# Altium project BW1092_R0M0E0.PrjPcb (part 3 of 7)

## Sheet BW1092_Connector.SchDoc: =project_title
size Tabloid; CompanyName: Luxonis Holding; DrawnBy: Brian Weinstein; Organization: Luxonis Holding; Address1: 1925 Harmony Park Drive; Address2: Westminster, CO; Address3: 80234; Address4: United States; DocumentNumber: DXXXX; Revision: R0M0E0; SheetNumber: 3; SheetTotal: 12
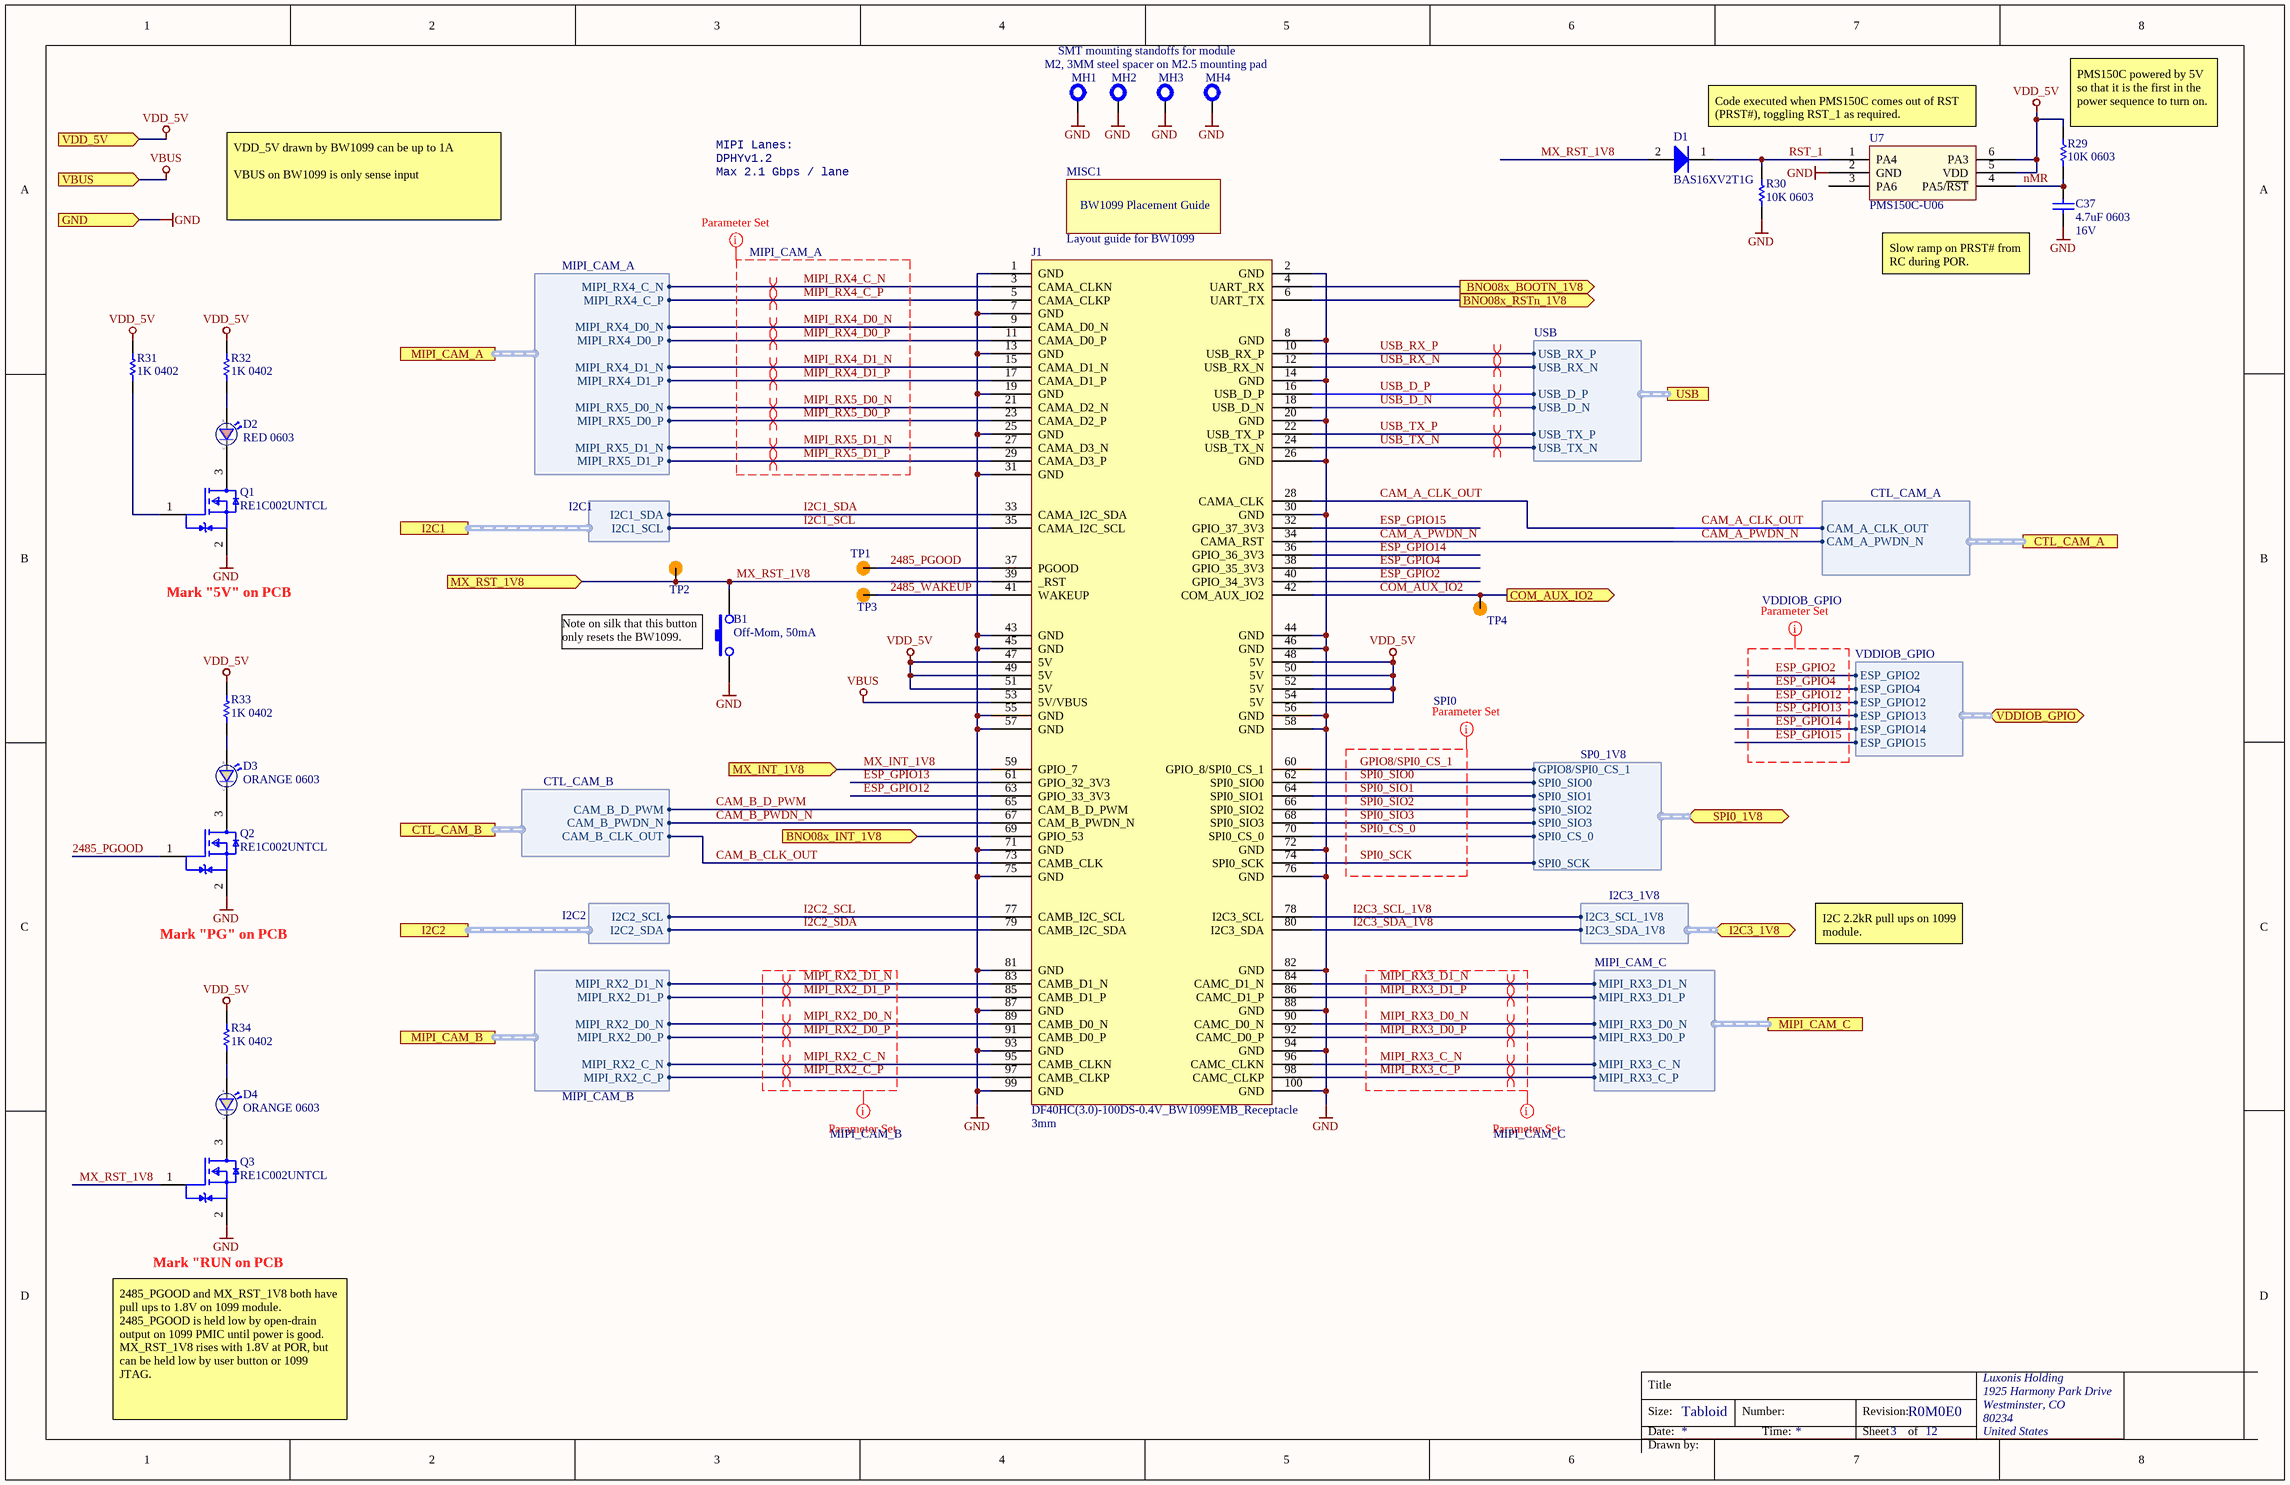
[diagram p2: BW1092_Connector.SchDoc]

### Parts
B1  Off-Mom, 50mA  [DTSM-32N-V]
C37  4.7uF 0603  Voltage Rating: 16V  [CAPC0603(1608)100_N]
D1  BAS16XV2T1G  [BAS16XV2T1G]
D2  RED 0603  [SML_D1xx8W]
D3  ORANGE 0603  [SML_D1xx8W]
D4  ORANGE 0603  [SML_D1xx8W]
J1  DF40HC(3.0)-100DS-0.4V_BW1099EMB_Receptacle  Mated Stacking Height: 3mm  [DF40HC-3.0-100DS-0.4V_minpad]
MH1  M2, 3MM steel spacer on M2.5 mounting pad  [9774030243R]  (value not drawn)
MH2  M2, 3MM steel spacer on M2.5 mounting pad  [9774030243R]  (value not drawn)
MH3  M2, 3MM steel spacer on M2.5 mounting pad  [9774030243R]  (value not drawn)
MH4  M2, 3MM steel spacer on M2.5 mounting pad  [9774030243R]
MISC1  Layout guide for BW1099  [BW1099_R3_KTHSNF_Footprint]  (no BOM)
Q1  RE1C002UNTCL  [RE1C002UNTCL]
Q2  RE1C002UNTCL  [RE1C002UNTCL]
Q3  RE1C002UNTCL  [RE1C002UNTCL]
R29  10K 0603  [RESC0603(1608)_N]
R30  10K 0603  [RESC0603(1608)_N]
R31  1K 0402  [RESC0402(1005)_L]
R32  1K 0402  [RESC0402(1005)_L]
R33  1K 0402  [RESC0402(1005)_L]
R34  1K 0402  [RESC0402(1005)_L]
TP1  TP100_200_NS  [TP100_200_NS]  (value not drawn)  (no BOM)
TP2  TP100_200_NS  [TP100_200_NS]  (value not drawn)  (no BOM)
TP3  TP100_200_NS  [TP100_200_NS]  (value not drawn)  (no BOM)
TP4  TP100_200_NS  [TP100_200_NS]  (value not drawn)  (no BOM)
U7  PMS150C-U06  [PMS150C-U06]

### Ports
BNO08x_BOOTN_1V8 (out), BNO08x_INT_1V8 (in), BNO08x_RSTn_1V8 (out), COM_AUX_IO2 (out), CTL_CAM_A (harness CTL_CAM_A), CTL_CAM_B (harness CTL_CAM_B), GND (in), I2C1 (harness I2C1), I2C2 (harness I2C2), I2C3_1V8 (bidir, harness I2C3_1V8), MIPI_CAM_A (harness MIPI_CAM_A), MIPI_CAM_B (harness MIPI_CAM_B), MIPI_CAM_C (harness MIPI_CAM_C), MX_INT_1V8 (in), MX_RST_1V8 (in), SPI0_1V8 (bidir, harness SP0_1V8), USB (harness USB), VBUS (in), VDD_5V (in), VDDIOB_GPIO (bidir, harness VDDIOB_GPIO)

### Harnesses
MIPI_CAM_B: MIPI_RX2_C_P, MIPI_RX2_C_N, MIPI_RX2_D0_P, MIPI_RX2_D0_N, MIPI_RX2_D1_P, MIPI_RX2_D1_N
MIPI_CAM_A: MIPI_RX4_C_P, MIPI_RX4_C_N, MIPI_RX4_D0_P, MIPI_RX4_D0_N, MIPI_RX4_D1_P, MIPI_RX4_D1_N, MIPI_RX5_D0_P, MIPI_RX5_D0_N, MIPI_RX5_D1_P, MIPI_RX5_D1_N
MIPI_CAM_C: MIPI_RX3_C_P, MIPI_RX3_C_N, MIPI_RX3_D0_P, MIPI_RX3_D0_N, MIPI_RX3_D1_P, MIPI_RX3_D1_N
I2C2: I2C2_SDA, I2C2_SCL
I2C1: I2C1_SDA, I2C1_SCL
CTL_CAM_B: CAM_B_CLK_OUT, CAM_B_PWDN_N, CAM_B_D_PWM
USB: USB_D_P, USB_D_N, USB_TX_N, USB_TX_P, USB_RX_N, USB_RX_P
CTL_CAM_A: CAM_A_PWDN_N, CAM_A_CLK_OUT
SP0_1V8: SPI0_SIO1, SPI0_SIO2, SPI0_SIO3, GPIO8/SPI0_CS_1, SPI0_SIO0, SPI0_CS_0, SPI0_SCK
I2C3_1V8: I2C3_SCL_1V8, I2C3_SDA_1V8
VDDIOB_GPIO: ESP_GPIO2, ESP_GPIO4, ESP_GPIO12, ESP_GPIO13, ESP_GPIO14, ESP_GPIO15

### Nets
GND: B1.1 C37.1 J1.1(GND) J1.2(GND) J1.7(GND) J1.8(GND) J1.13(GND) J1.14(GND) J1.19(GND) J1.20(GND) J1.25(GND) J1.26(GND) J1.30(GND) J1.31(GND) J1.43(GND) J1.44(GND) J1.45(GND) J1.46(GND) J1.55(GND) J1.56(GND) J1.57(GND) J1.58(GND) J1.71(GND) J1.72(GND) J1.75(GND) J1.76(GND) J1.81(GND) J1.82(GND) J1.87(GND) J1.88(GND) J1.93(GND) J1.94(GND) J1.99(GND) J1.100(GND) MH1.1 MH2.1 MH3.1 MH4.1 Q1.2(Source) Q2.2(Source) Q3.2(Source) R30.1 U7.2(GND) ; port GND
VBUS: J1.53(5V/VBUS) ; port VBUS
VDD_5V: J1.47(5V) J1.48(5V) J1.49(5V) J1.50(5V) J1.51(5V) J1.52(5V) J1.54(5V) R29.2 R31.2 R32.2 R33.2 R34.2 U7.5(VDD) U7.6(PA3) ; port VDD_5V
2485_PGOOD: J1.37(PGOOD) Q2.1(Gate) TP1.1
2485_WAKEUP: J1.41(WAKEUP) TP3.1
CAM_A_CLK_OUT: J1.28(CAMA_CLK) ; port CTL_CAM_A.CAM_A_CLK_OUT
CAM_A_PWDN_N: J1.34(CAMA_RST) ; port CTL_CAM_A.CAM_A_PWDN_N
CAM_B_CLK_OUT: J1.73(CAMB_CLK) ; port CTL_CAM_B.CAM_B_CLK_OUT
CAM_B_D_PWM: J1.65(CAM_B_D_PWM) ; port CTL_CAM_B.CAM_B_D_PWM
CAM_B_PWDN_N: J1.67(CAM_B_PWDN_N) ; port CTL_CAM_B.CAM_B_PWDN_N
COM_AUX_IO2: J1.42(COM_AUX_IO2) TP4.1 ; port COM_AUX_IO2
ESP_GPIO2: J1.40(GPIO_34_3V3) ; port VDDIOB_GPIO.ESP_GPIO2
ESP_GPIO4: J1.38(GPIO_35_3V3) ; port VDDIOB_GPIO.ESP_GPIO4
ESP_GPIO12: J1.63(GPIO_33_3V3) ; port VDDIOB_GPIO.ESP_GPIO12
ESP_GPIO13: J1.61(GPIO_32_3V3) ; port VDDIOB_GPIO.ESP_GPIO13
ESP_GPIO14: J1.36(GPIO_36_3V3) ; port VDDIOB_GPIO.ESP_GPIO14
ESP_GPIO15: J1.32(GPIO_37_3V3) ; port VDDIOB_GPIO.ESP_GPIO15
GPIO8/SPI0_CS_1: J1.60(GPIO_8/SPI0_CS_1) ; port SPI0_1V8.GPIO8/SPI0_CS_1
I2C1_SCL: J1.35(CAMA_I2C_SCL) ; port I2C1.I2C1_SCL
I2C1_SDA: J1.33(CAMA_I2C_SDA) ; port I2C1.I2C1_SDA
I2C2_SCL: J1.77(CAMB_I2C_SCL) ; port I2C2.I2C2_SCL
I2C2_SDA: J1.79(CAMB_I2C_SDA) ; port I2C2.I2C2_SDA
I2C3_SCL_1V8: J1.78(I2C3_SCL) ; port I2C3_1V8.I2C3_SCL_1V8
I2C3_SDA_1V8: J1.80(I2C3_SDA) ; port I2C3_1V8.I2C3_SDA_1V8
MIPI_RX2_C_N: J1.95(CAMB_CLKN) ; port MIPI_CAM_B.MIPI_RX2_C_N
MIPI_RX2_C_P: J1.97(CAMB_CLKP) ; port MIPI_CAM_B.MIPI_RX2_C_P
MIPI_RX2_D0_N: J1.89(CAMB_D0_N) ; port MIPI_CAM_B.MIPI_RX2_D0_N
MIPI_RX2_D0_P: J1.91(CAMB_D0_P) ; port MIPI_CAM_B.MIPI_RX2_D0_P
MIPI_RX2_D1_N: J1.83(CAMB_D1_N) ; port MIPI_CAM_B.MIPI_RX2_D1_N
MIPI_RX2_D1_P: J1.85(CAMB_D1_P) ; port MIPI_CAM_B.MIPI_RX2_D1_P
MIPI_RX3_C_N: J1.96(CAMC_CLKN) ; port MIPI_CAM_C.MIPI_RX3_C_N
MIPI_RX3_C_P: J1.98(CAMC_CLKP) ; port MIPI_CAM_C.MIPI_RX3_C_P
MIPI_RX3_D0_N: J1.90(CAMC_D0_N) ; port MIPI_CAM_C.MIPI_RX3_D0_N
MIPI_RX3_D0_P: J1.92(CAMC_D0_P) ; port MIPI_CAM_C.MIPI_RX3_D0_P
MIPI_RX3_D1_N: J1.84(CAMC_D1_N) ; port MIPI_CAM_C.MIPI_RX3_D1_N
MIPI_RX3_D1_P: J1.86(CAMC_D1_P) ; port MIPI_CAM_C.MIPI_RX3_D1_P
MIPI_RX4_C_N: J1.3(CAMA_CLKN) ; port MIPI_CAM_A.MIPI_RX4_C_N
MIPI_RX4_C_P: J1.5(CAMA_CLKP) ; port MIPI_CAM_A.MIPI_RX4_C_P
MIPI_RX4_D0_N: J1.9(CAMA_D0_N) ; port MIPI_CAM_A.MIPI_RX4_D0_N
MIPI_RX4_D0_P: J1.11(CAMA_D0_P) ; port MIPI_CAM_A.MIPI_RX4_D0_P
MIPI_RX4_D1_N: J1.15(CAMA_D1_N) ; port MIPI_CAM_A.MIPI_RX4_D1_N
MIPI_RX4_D1_P: J1.17(CAMA_D1_P) ; port MIPI_CAM_A.MIPI_RX4_D1_P
MIPI_RX5_D0_N: J1.21(CAMA_D2_N) ; port MIPI_CAM_A.MIPI_RX5_D0_N
MIPI_RX5_D0_P: J1.23(CAMA_D2_P) ; port MIPI_CAM_A.MIPI_RX5_D0_P
MIPI_RX5_D1_N: J1.27(CAMA_D3_N) ; port MIPI_CAM_A.MIPI_RX5_D1_N
MIPI_RX5_D1_P: J1.29(CAMA_D3_P) ; port MIPI_CAM_A.MIPI_RX5_D1_P
MX_INT_1V8: J1.59(GPIO_7) ; port MX_INT_1V8
MX_RST_1V8: B1.2 D1.2(A) J1.39(_RST) Q3.1(Gate) TP2.1 ; port MX_RST_1V8
nMR: C37.2 R29.1 U7.4(PA5/~{RST})
RST_1: D1.1(K) R30.2 U7.1(PA4)
SPI0_CS_0: J1.70(SPI0_CS_0) ; port SPI0_1V8.SPI0_CS_0
SPI0_SCK: J1.74(SPI0_SCK) ; port SPI0_1V8.SPI0_SCK
SPI0_SIO0: J1.62(SPI0_SIO0) ; port SPI0_1V8.SPI0_SIO0
SPI0_SIO1: J1.64(SPI0_SIO1) ; port SPI0_1V8.SPI0_SIO1
SPI0_SIO2: J1.66(SPI0_SIO2) ; port SPI0_1V8.SPI0_SIO2
SPI0_SIO3: J1.68(SPI0_SIO3) ; port SPI0_1V8.SPI0_SIO3
USB_D_N: J1.18(USB_D_N) ; port USB.USB_D_N
USB_D_P: J1.16(USB_D_P) ; port USB.USB_D_P
USB_RX_N: J1.12(USB_RX_N) ; port USB.USB_RX_N
USB_RX_P: J1.10(USB_RX_P) ; port USB.USB_RX_P
USB_TX_N: J1.24(USB_TX_N) ; port USB.USB_TX_N
USB_TX_P: J1.22(USB_TX_P) ; port USB.USB_TX_P
NetD2_1: D2.1(C) Q1.3(Drain)
NetD2_2: D2.2(A) R32.1
NetD3_1: D3.1(C) Q2.3(Drain)
NetD3_2: D3.2(A) R33.1
NetD4_1: D4.1(C) Q3.3(Drain)
NetD4_2: D4.2(A) R34.1
NetJ1_4: J1.4(UART_RX) ; port BNO08x_BOOTN_1V8
NetJ1_6: J1.6(UART_TX) ; port BNO08x_RSTn_1V8
NetJ1_69: J1.69(GPIO_53) ; port BNO08x_INT_1V8
NetQ1_1: Q1.1(Gate) R31.1

Not connected (* = marked no-connect by the designer): U7 3(PA6)

### Layout directives
net class MIPI_CAM_C; rule Matched Net Lengths [Delay Tolerance = 1ps]: MIPI_RX3_C_N, MIPI_RX3_C_P, MIPI_RX3_D0_N, MIPI_RX3_D0_P, MIPI_RX3_D1_N, MIPI_RX3_D1_P
net class MIPI_CAM_A; rule Matched Net Lengths [Delay Tolerance = 1ps]: MIPI_RX4_C_N, MIPI_RX4_C_P, MIPI_RX4_D0_N, MIPI_RX4_D0_P, MIPI_RX4_D1_N, MIPI_RX4_D1_P, MIPI_RX5_D0_N, MIPI_RX5_D0_P, MIPI_RX5_D1_N, MIPI_RX5_D1_P
net class MIPI_CAM_B; rule Matched Net Lengths [Delay Tolerance = 1ps]: MIPI_RX2_C_N, MIPI_RX2_C_P, MIPI_RX2_D0_N, MIPI_RX2_D0_P, MIPI_RX2_D1_N, MIPI_RX2_D1_P
differential pair; differential pair class 100ohm: MIPI_RX2_C_N, MIPI_RX2_C_P, MIPI_RX2_D0_N, MIPI_RX2_D0_P, MIPI_RX2_D1_N, MIPI_RX2_D1_P, MIPI_RX3_C_N, MIPI_RX3_C_P, MIPI_RX3_D0_N, MIPI_RX3_D0_P, MIPI_RX3_D1_N, MIPI_RX3_D1_P, MIPI_RX4_C_N, MIPI_RX4_C_P, MIPI_RX4_D0_N, MIPI_RX4_D0_P, MIPI_RX4_D1_N, MIPI_RX4_D1_P, MIPI_RX5_D0_N, MIPI_RX5_D0_P, MIPI_RX5_D1_N, MIPI_RX5_D1_P
differential pair; differential pair class USB3: USB_D_N, USB_D_P, USB_RX_N, USB_RX_P, USB_TX_N, USB_TX_P
net class SPI0; rule Matched Net Lengths [Delay Tolerance = 50ps]: GPIO8/SPI0_CS_1, SPI0_CS_0, SPI0_SCK, SPI0_SIO0, SPI0_SIO1, SPI0_SIO2, SPI0_SIO3
net class VDDIOB_GPIO; rule Matched Net Lengths [Delay Tolerance = 50ps]: ESP_GPIO2, ESP_GPIO4, ESP_GPIO12, ESP_GPIO13, ESP_GPIO14, ESP_GPIO15

### Notes on the sheet
- SMT mounting standoffs for module
- MIPI Lanes:
- DPHYv1.2
- Code executed when PMS150C comes out of RST (PRST#), toggling RST_1 as required.
- (near R29) PMS150C powered by 5V so that it is the first in the power sequence to turn on.
- VDD_5V drawn by BW1099 can be up to 1A
  VBUS on BW1099 is only sense input
- Max 2.1 Gbps / lane
- Slow ramp on PRST# from RC during POR.
- Mark "5V" on PCB
- (near B1) Note on silk that this button only resets the BW1099.
- Mark "PG" on PCB
- I2C 2.2kR pull ups on 1099 module.
- Mark "RUN on PCB
- 2485_PGOOD and MX_RST_1V8 both have pull ups to 1.8V on 1099 module. 2485_PGOOD is held low by open-drain output on 1099 PMIC until power is good. MX_RST_1V8 rises with 1.8V at POR, but can be held low by user button or 1099 JTAG.
- Title
- Size:
- Date:
- Tabloid
- Number:
- Time:
- Revision:
- Sheet
- of
- Drawn by:
- (in symbol BW1099_Footprint) BW1099 Placement Guide

### Library data of the parts
B1 = DTSM-32N-V: SWITCH TACTILE SMT 3.5mm * 6mm , brown 160gf; Manufacturer 1: Diptronics; Manufacturer Part Number 1: DTSM-32N-V-T/R; Supplier 1: Mouser; Stock 1: 3199; Pricing 1: 1=0.38000, 10=0.38000, 50=0.31000, 100=0.28200, 500=0.25600, 1000=0.23600, 1600=0.20900, 4800=0.18800, 9600=0.17300, 10000=0.17300, 24000=0.16100 (USD); RoHS: No; Min Operating Temperature: -30°C; Max Operating Temperature: 80°C; Length: 6mm; Height: 5mm; Width: 3.5mm; ComponentLink1URL: https://datasheet.ciiva.com/29188/708548-da-01-en-tastschalter-smd-dtsm-32n-v-tr-1600st-29188823.pdf?src-supplier=Conrad; ComponentLink1Description: https://datasheet.ciiva.com/29188/708548-da-01-en-tastschalter-smd-dtsm-32n-v-tr-1600st-29188823.pdf?src-supplier=Conrad; Supplier Part Number 1: 113-DTSM32NVTR
C37 = GRM188R61C475KAAJD: CAP CER 4.7UF 16V X5R 0603 10%; Manufacturer 1: Murata; Material: Ceramic; Supplier 1: Digi-Key; Manufacturer Part Number 1: GRM188R61C475KAAJD; Stock 1: 455058; Pricing 1: 1=0.35000, 10=0.24600, 100=0.14730, 500=0.11050, 1000=0.09331 (USD); RoHS: Yes; Mount: Surface Mount; Case/Package: 0603; Weight: 0.000222oz; Case Code (Metric): 1608; Case Code (Imperial): 0603; Min Operating Temperature: -55°C; Max Operating Temperature: 85°C; Capacitance: 4.7uF; Tolerance: 10%; Packaging: Tape and Reel; Dielectric: X5R; Termination: SMD/SMT; Voltage Rating (DC): 16V; Package Quantity: 4000; Length: 1.6mm; Height: 0.8mm; Width: 0.8mm; Thickness: 0.037inch; Depth: 0.8mm; REACH SVHC: No SVHC; Lead Free: Lead Free; ComponentLink1URL: https://datasheet.ciiva.com/14813/595grm188r61c475kaaj23-14813668.pdf?src-supplier=Arrow; ComponentLink1Description: https://datasheet.ciiva.com/14813/595grm188r61c475kaaj23-14813668.pdf?src-supplier=Arrow; Supplier 2: Digi-Key; Manufacturer 2: Murata; Manufacturer Part Number 2: GRM188R61C475KAAJD; Stock 2: 455058; Pricing 2: 1=0.35000, 10=0.24600, 100=0.14730, 500=0.11050, 1000=0.09331 (USD); Supplier 3: Digi-Key; Manufacturer 3: Murata; Manufacturer Part Number 3: GRM188R61C475KAAJD; Stock 3: 452000; Pricing 3: 4000=0.07259, 8000=0.06832, 12000=0.06619, 28000=0.06405 (USD); Supplier Part Number 1: 490-10481-1-ND; Supplier Part Number 2: 490-10481-6-ND; Supplier Part Number 3: 490-10481-2-ND
D1 = BAS16XV2T1G: DIODE GEN PURP 75V 200MA SOD523; Manufacturer 1: ON Semiconductor; Peak Reverse Current: 1uA; Reverse Recovery Time: 6ns; Power Dissipation: 200mW; Element Configuration: Single; Max Surge Current: 500mA; Forward Voltage: 1.25V; Polarity: Standard; Capacitance: 2pF; Supplier 1: Digi-Key; Manufacturer Part Number 1: BAS16XV2T1G; Stock 1: 246371; Pricing 1: 1=0.13000, 10=0.11600, 100=0.06330, 500=0.03898, 1000=0.02658 (USD); RoHS: Yes; Case/Package: SOD-523-2; Number of Pins: 2; Contact Plating: Tin,Matte; Min Operating Temperature: -55°C; Max Operating Temperature: 150°C; Package Quantity: 1; Forward Current: 200mA; Packaging: Tape and Reel; Average Rectified Current: 200mA; Max Repetitive Reverse Voltage (Vrrm): 75V; Max Reverse Voltage (DC): 75V; Recovery Time: 6ns; Max Reverse Leakage Current: 1uA; Peak Non-Repetitive Surge Current: 500mA; Max Forward Surge Current (Ifsm): 500mA; Output Current: 200mA; Length: 1.3mm; Height: 0.7mm; Width: 0.9mm; Radiation Hardening: No; Lead Free: Lead Free; Halogen Free: Halogen Free; REACH SVHC: No SVHC; ComponentLink1URL: https://datasheet.ciiva.com/915/bas16xv2t1-d-915360.pdf?src-supplier=Digi-Key; ComponentLink1Description: https://datasheet.ciiva.com/915/bas16xv2t1-d-915360.pdf?src-supplier=Digi-Key; ComponentLink2URL: https://datasheet.ciiva.com/4434/bas16xv2t1-d-103464-4434928.pdf?src-supplier=Mouser; ComponentLink2Description: https://datasheet.ciiva.com/4434/bas16xv2t1-d-103464-4434928.pdf?src-supplier=Mouser; ComponentLink3URL: https://datasheet.ciiva.com/22663/1708232-22663646.pdf?src-supplier=Element14; ComponentLink3Description: https://datasheet.ciiva.com/22663/1708232-22663646.pdf?src-supplier=Element14; ComponentLink4URL: https://datasheet.ciiva.com/36525/806485-36525908.pdf?src-supplier=Jameco; ComponentLink4Description: https://datasheet.ciiva.com/36525/806485-36525908.pdf?src-supplier=Jameco; ComponentLink5URL: https://datasheet.ciiva.com/15144/getdatasheetpartid-84399-15144565.pdf?src-supplier=Verical; ComponentLink5Description: https://datasheet.ciiva.com/15144/getdatasheetpartid-84399-15144565.pdf?src-supplier=Verical; ComponentLink6URL: https://datasheet.ciiva.com/16475/bas16xv2t1-d-16475723.pdf?src-supplier=Avnet+Asia; ComponentLink6Description: https://datasheet.ciiva.com/16475/bas16xv2t1-d-16475723.pdf?src-supplier=Avnet+Asia; ComponentLink7URL: https://datasheet.ciiva.com/25930/bas16xv2t1-d-25930683.pdf?src-supplier=Avnet+Europe; ComponentLink7Description: https://datasheet.ciiva.com/25930/bas16xv2t1-d-25930683.pdf?src-supplier=Avnet+Europe; Supplier 2: Digi-Key; Manufacturer 2: ON Semiconductor; Manufacturer Part Number 2: BAS16XV2T1G; Stock 2: 246371; Pricing 2: 1=0.13000, 10=0.11600, 100=0.06330, 500=0.03898, 1000=0.02658 (USD); Supplier Part Number 1: BAS16XV2T1GOSCT-ND; Supplier Part Number 2: BAS16XV2T1GOSDKR-ND
D2 = SML-D12U8WT86: LED RED DIFFUSED 0603 SMD Red 620nm LED Indication - Discrete 2.2V 0603 (1608 Metric); Manufacturer 1: Rohm; Lens Color: White,Clear,Diffused; Lens Style: Rectangular,Diffused,Colorless; Forward Current: 20mA; Luminous Intensity: 63mcd; Number of LEDs: 1; Viewing Angle: 160°; RoHS: Yes; Mount: Surface Mount; Case/Package: 0603; Number of Pins: 2; Color: Red; Case Code (Metric): 1608; Case Code (Imperial): 0603; Min Operating Temperature: -40°C; Max Operating Temperature: 85°C; Forward Voltage: 2.2V; Packaging: Tape and Reel; Dominant Wavelength: 620nm; Wavelength: 620nm; Package Quantity: 1; Illumination Color: Red; Test Current: 20mA; Lens Transparency: Diffused; Length: 1.6mm; Height: 0.65mm; Width: 0.8mm; Radiation Hardening: No; REACH SVHC: No SVHC; Lead Free: Lead Free; ComponentLink1URL: https://datasheet.ciiva.com/11774/0900766b80df3ada-11774020.pdf?src-supplier=RSComponents; ComponentLink1Description: https://datasheet.ciiva.com/11774/0900766b80df3ada-11774020.pdf?src-supplier=RSComponents; ComponentLink2URL: https://datasheet.ciiva.com/2110/sml-d1-2110375.pdf?src-supplier=Digi-Key; ComponentLink2Description: https://datasheet.ciiva.com/2110/sml-d1-2110375.pdf?src-supplier=Digi-Key; ComponentLink3URL: https://datasheet.ciiva.com/2110/sml-d1-2110376.pdf?src-supplier=Digi-Key; ComponentLink3Description: https://datasheet.ciiva.com/2110/sml-d1-2110376.pdf?src-supplier=Digi-Key; ComponentLink4URL: https://datasheet.ciiva.com/2110/sml-d1-2110377.pdf?src-supplier=Digi-Key; ComponentLink4Description: https://datasheet.ciiva.com/2110/sml-d1-2110377.pdf?src-supplier=Digi-Key; ComponentLink5URL: https://datasheet.ciiva.com/9324/sml-d1-9324826.pdf?src-supplier=Avnet; ComponentLink5Description: https://datasheet.ciiva.com/9324/sml-d1-9324826.pdf?src-supplier=Avnet; ComponentLink6URL: https://datasheet.ciiva.com/17420/sml-d1-17420939.pdf?src-supplier=Avnet+Europe; ComponentLink6Description: https://datasheet.ciiva.com/17420/sml-d1-17420939.pdf?src-supplier=Avnet+Europe; Supplier 1: Digi-Key; Manufacturer Part Number 1: SML-D12U8WT86; Stock 1: 63748; Pricing 1: 1=0.33000, 10=0.23900, 100=0.11340, 500=0.07560, 1000=0.05922 (USD); Supplier Part Number 1: 511-1580-1-ND
D3 D4 = SML-D12D8WT86: LED ORANGE DIFFUSED 0603 SMD Orange 605nm LED Indication - Discrete 2.2V 0603 (1608 Metric); Manufacturer 1: Rohm; Lens Color: White; Lens Style: Diffused,Colorless,Rectangular; Number of LEDs: 1; Viewing Angle: 160°; Forward Current: 20mA; Luminous Intensity: 100mcd; Supplier 1: Digi-Key; Stock 1: 29355; Pricing 1: 1=0.33000, 10=0.23900, 100=0.11340, 500=0.07560, 1000=0.05922 (USD); RoHS: Yes; Mount: Surface Mount; Case/Package: 0603; Number of Pins: 2; Color: Orange; Case Code (Metric): 1608; Case Code (Imperial): 0603; Min Operating Temperature: -40°C; Max Operating Temperature: 85°C; Dominant Wavelength: 605nm; Forward Voltage: 2.2V; Package Quantity: 1; Packaging: Tape and Reel; Illumination Color: Orange; Test Current: 20mA; Lens Transparency: Diffused; Wavelength: 605nm; Length: 1.6mm; Height: 0.65mm; Width: 0.8mm; Radiation Hardening: No; REACH SVHC: Unknown; Lead Free: Lead Free; ComponentLink1URL: https://datasheet.ciiva.com/2115/sml-d1-2115577.pdf?src-supplier=Digi-Key; ComponentLink1Description: https://datasheet.ciiva.com/2115/sml-d1-2115577.pdf?src-supplier=Digi-Key; ComponentLink2URL: https://datasheet.ciiva.com/2115/sml-d1-2115578.pdf?src-supplier=Digi-Key; ComponentLink2Description: https://datasheet.ciiva.com/2115/sml-d1-2115578.pdf?src-supplier=Digi-Key; ComponentLink3URL: https://datasheet.ciiva.com/3161/sml-d1-3161418.pdf?src-supplier=Avnet; ComponentLink3Description: https://datasheet.ciiva.com/3161/sml-d1-3161418.pdf?src-supplier=Avnet; ComponentLink4URL: https://datasheet.ciiva.com/16387/sml-d1-16387850.pdf?src-supplier=Future+Electronics; ComponentLink4Description: https://datasheet.ciiva.com/16387/sml-d1-16387850.pdf?src-supplier=Future+Electronics; ComponentLink5URL: https://datasheet.ciiva.com/2115/sml-d1-2115579.pdf?src-supplier=Digi-Key; ComponentLink5Description: https://datasheet.ciiva.com/2115/sml-d1-2115579.pdf?src-supplier=Digi-Key; ComponentLink6URL: https://datasheet.ciiva.com/17419/sml-d1-17419886.pdf?src-supplier=Avnet+Europe; ComponentLink6Description: https://datasheet.ciiva.com/17419/sml-d1-17419886.pdf?src-supplier=Avnet+Europe; Supplier Part Number 1: 511-1577-1-ND; Manufacturer Part Number 1: SML-D12D8WT86
J1 = DF40HC(3.0)-100DS-0.4V_BW1099EMB: CONN RCPT 100POS 0.4MM SMD GOLD EMB PINOUT; Manufacturer 1: Hirose; Manufacturer Part Number 1: DF40HC(3.0)-100DS-0.4V(51; Number of Positions: 100; Pitch: 0.016inch; RoHS: Yes; Mount: Surface Mount; Contact Plating: Gold; Packaging: Tape and Reel; Number of Rows: 2; Package Quantity: 1000; Connector Type: Receptacle; Lead Free: Lead Free; ComponentLink1URL: https://datasheet.ciiva.com/46636/ed-df40-20140305-46636517.pdf?src-supplier=Digi-Key; ComponentLink1Description: https://datasheet.ciiva.com/46636/ed-df40-20140305-46636517.pdf?src-supplier=Digi-Key; ComponentLink2URL: https://datasheet.ciiva.com/18562/ed-df40-20140305-18562189.pdf?src-supplier=Digi-Key; ComponentLink2Description: https://datasheet.ciiva.com/18562/ed-df40-20140305-18562189.pdf?src-supplier=Digi-Key; ComponentLink3URL: https://datasheet.ciiva.com/13559/ed-df40-20140305-13559540.pdf?src-supplier=Mouser; ComponentLink3Description: https://datasheet.ciiva.com/13559/ed-df40-20140305-13559540.pdf?src-supplier=Mouser; ComponentLink4URL: https://datasheet.ciiva.com/18562/ed-df40-20140305-18562462.pdf?src-supplier=Digi-Key; ComponentLink4Description: https://datasheet.ciiva.com/18562/ed-df40-20140305-18562462.pdf?src-supplier=Digi-Key; Supplier 1: Mouser; Stock 1: 2172; Pricing 1: 1=2.54000, 10=2.26000, 25=2.07000, 50=2.07000, 100=1.98000, 250=1.79000, 500=1.65000, 1000=1.41000, 3000=1.32000, 6000=1.23000, 10000=1.23000 (USD); Supplier 2: Mouser; Manufacturer 2: Hirose; Manufacturer Part Number 2: DF40HC(3.0)-100DS-0.4V(58); Stock 2: 2078; Pricing 2: 1=2.50000, 10=2.40000, 25=2.10000, 50=2.10000, 100=2.00000, 250=1.76000, 500=1.71000, 1000=1.45000, 2000=1.36000, 5000=1.31000, 10000=1.31000 (USD); Supplier Part Number 1: 798-DF40HC30100DS451; Supplier Part Number 2: 798-DF40HC30100DS458
MH1-MH4 = 9774030243R: MP ROUND STANDOFF M2X0.4 STEEL 3MM; Manufacturer 1: Wurth Electronics; Plating: Tin; Threaded/Unthreaded: Threaded; Outside Diameter: 0.171inch; Supplier 1: Digi-Key; Manufacturer Part Number 1: 9774030243R; Stock 1: 20568; Pricing 1: 1=0.95000, 10=0.91800, 50=0.79500, 100=0.73900 (USD); RoHS: Yes; Material: Steel; Length: 0.173inch; REACH SVHC: Unknown; ComponentLink1URL: http://www.mouser.com/ds/2/445/9774030243R-611455.pdf?src-supplier=Mouser; ComponentLink1Description: http://www.mouser.com/ds/2/445/9774030243R-611455.pdf?src-supplier=Mouser; ComponentLink2URL: http://www.farnell.com/datasheets/1960368.pdf?src-supplier=Farnell; ComponentLink2Description: http://www.farnell.com/datasheets/1960368.pdf?src-supplier=Farnell; ComponentLink3URL: https://katalog.we-online.de/em/datasheet/9774030243R.pdf?src-supplier=Digi-Key; ComponentLink3Description: https://katalog.we-online.de/em/datasheet/9774030243R.pdf?src-supplier=Digi-Key; ComponentLink4URL: http://www.farnell.com/datasheets/1960368.pdf?src-supplier=Newark; ComponentLink4Description: http://www.farnell.com/datasheets/1960368.pdf?src-supplier=Newark; ComponentLink5URL: http://www.farnell.com/datasheets/1960368.pdf?src-supplier=Element14; ComponentLink5Description: http://www.farnell.com/datasheets/1960368.pdf?src-supplier=Element14; Supplier Part Number 1: 732-7085-1-ND
MISC1 = BW1099_Footprint: MISC - Use for aligning BW1099 mount
Q1-Q3 = RE1C002UNTCL: MOSFET N-CH 20V 0.2A EMT3; Manufacturer 1: Rohm; Continuous Drain Current (ID): 200mA; Rds On Max: 1.2R; Input Capacitance: 25pF; Max Power Dissipation: 150mW; RoHS: Yes; Mount: Surface Mount; Case/Package: SOT-89; Packaging: Tape and Reel; Drain to Source Voltage (Vdss): 20V; Lead Free: Lead Free; ComponentLink1URL: http://www.mouser.com/ds/2/348/re1c002untcl-e-1018231.pdf?src-supplier=Mouser; ComponentLink1Description: http://www.mouser.com/ds/2/348/re1c002untcl-e-1018231.pdf?src-supplier=Mouser; ComponentLink2URL: http://rohmfs.rohm.com/en/techdata_basic/transistor/taping/EMT3_TL_taping.pdf?src-supplier=Digi-Key; ComponentLink2Description: http://rohmfs.rohm.com/en/techdata_basic/transistor/taping/EMT3_TL_taping.pdf?src-supplier=Digi-Key; ComponentLink3URL: http://rohmfs.rohm.com/en/products/databook/datasheet/discrete/transistor/mosfet/re1c002un.pdf?src-supplier=Avnet; ComponentLink3Description: http://rohmfs.rohm.com/en/products/databook/datasheet/discrete/transistor/mosfet/re1c002un.pdf?src-supplier=Avnet; ComponentLink4URL: https://www.rohm.com/datasheet/RE1C002UN/re1c002untcl-e?src-supplier=Digi-Key; ComponentLink4Description: https://www.rohm.com/datasheet/RE1C002UN/re1c002untcl-e?src-supplier=Digi-Key; ComponentLink5URL: http://www.farnell.com/datasheets/2704376.pdf?src-supplier=Newark; ComponentLink5Description: http://www.farnell.com/datasheets/2704376.pdf?src-supplier=Newark; ComponentLink6URL: http://www.farnell.com/datasheets/2704376.pdf?src-supplier=Farnell; ComponentLink6Description: http://www.farnell.com/datasheets/2704376.pdf?src-supplier=Farnell; ComponentLink7URL: http://www.farnell.com/datasheets/2704376.pdf?src-supplier=Element14; ComponentLink7Description: http://www.farnell.com/datasheets/2704376.pdf?src-supplier=Element14; Supplier 1: Digi-Key; Manufacturer Part Number 1: RE1C002UNTCL; Stock 1: 868886; Pricing 1: 1=0.20000, 10=0.18200, 100=0.09930, 500=0.06112, 1000=0.04167 (USD); Supplier Part Number 1: RE1C002UNTCLCT-ND
R29 R30 = RC0603FR-0710KL: RES SMD 10K OHM 1% 1/10W 0603; Manufacturer 1: Yageo; Resistance: 10kR; Power Rating: 100mW; Temperature Coefficient: 100ppm/°C; Voltage Rating: 75V; Voltage Rating (DC): 50V; Supplier 1: Digi-Key; Manufacturer Part Number 1: RC0603FR-0710KL; Stock 1: 80414305; Pricing 1: 1=0.10000, 10=0.02200, 100=0.00890, 1000=0.00401, 2500=0.00348 (USD); RoHS: Yes; Case/Package: 0603; Number of Pins: 2; Weight: 7.1E-05oz; Case Code (Imperial): 0603; Case Code (Metric): 1608; Min Operating Temperature: -55°C; Max Operating Temperature: 155°C; Packaging: Tape and Reel; Tolerance: 1%; Composition: Thick Film; Termination: SMD/SMT; Military Standard: Not; Length: 1.6mm; Height: 0.45mm; Depth: 0.8mm; Width: 0.8mm; Lead Pitch: 0.3mm; Lead Free: Lead Free; REACH SVHC: No SVHC; ComponentLink1URL: https://datasheet.ciiva.com/7660/38590-7660789.pdf?src-supplier=Element14; ComponentLink1Description: https://datasheet.ciiva.com/7660/38590-7660789.pdf?src-supplier=Element14; ComponentLink2URL: https://datasheet.ciiva.com/15189/getdatasheetpartid-409289-15189591.pdf?src-supplier=Verical; ComponentLink2Description: https://datasheet.ciiva.com/15189/getdatasheetpartid-409289-15189591.pdf?src-supplier=Verical; ComponentLink3URL: https://datasheet.ciiva.com/46440/1868787-46440891.pdf?src-supplier=Element14; ComponentLink3Description: https://datasheet.ciiva.com/46440/1868787-46440891.pdf?src-supplier=Element14; ComponentLink4URL: https://datasheet.ciiva.com/7983/443971-7983596.pdf?src-supplier=Element14; ComponentLink4Description: https://datasheet.ciiva.com/7983/443971-7983596.pdf?src-supplier=Element14; ComponentLink5URL: https://datasheet.ciiva.com/7746/1738695-7746239.pdf?src-supplier=Element14; ComponentLink5Description: https://datasheet.ciiva.com/7746/1738695-7746239.pdf?src-supplier=Element14; ComponentLink6URL: https://datasheet.ciiva.com/22747/443971-22747519.pdf?src-supplier=Element14; ComponentLink6Description: https://datasheet.ciiva.com/22747/443971-22747519.pdf?src-supplier=Element14; Supplier 2: Digi-Key; Manufacturer 2: Yageo; Manufacturer Part Number 2: RC0603FR-0710KL; Stock 2: 80414305; Pricing 2: 1=0.10000, 10=0.02200, 100=0.00890, 1000=0.00401, 2500=0.00348 (USD); Supplier 3: Digi-Key; Manufacturer 3: Yageo; Manufacturer Part Number 3: RC0603FR-0710KL; Stock 3: 80410000; Pricing 3: 5000=0.00261, 10000=0.00227, 25000=0.00199, 50000=0.00183, 125000=0.00179 (USD); Supplier Part Number 1: 311-10.0KHRCT-ND; Supplier Part Number 2: 311-10.0KHRDKR-ND; Supplier Part Number 3: 311-10.0KHRTR-ND
R31-R34 = RC0402FR-071KL: RES SMD 1K OHM 1% 1/16W 0402 1 kOhms ±1% 0.063W, 1/16W Chip Resistor 0402 (1005 Metric) Moisture Resistant Thick Film; Manufacturer 1: Yageo; Temperature Coefficient: 100ppm/°C; Power Rating: 62.5mW; Voltage Rating (DC): 50V; Resistance: 1kR; RoHS: Yes; Number of Pins: 2; Case Code (Imperial): 0402; Case Code (Metric): 1005; Min Operating Temperature: -55°C; Max Operating Temperature: 155°C; Packaging: Tape and Reel; Composition: Thick Film; Voltage Rating: 50V; Military Standard: Not; Termination: SMD/SMT; Length: 1mm; Height: 0.32mm; Width: 0.5mm; Depth: 0.5mm; Lead Free: Lead Free; REACH SVHC: Unknown; ComponentLink1URL: https://datasheet.ciiva.com/11819/0900766b80c66297-11819477.pdf?src-supplier=RSComponents; ComponentLink1Description: https://datasheet.ciiva.com/11819/0900766b80c66297-11819477.pdf?src-supplier=RSComponents; ComponentLink2URL: https://datasheet.ciiva.com/12666/pyu-rc0402-51-rohs-l-6-r-12666741.pdf?src-supplier=Mouser; ComponentLink2Description: https://datasheet.ciiva.com/12666/pyu-rc0402-51-rohs-l-6-r-12666741.pdf?src-supplier=Mouser; ComponentLink3URL: https://datasheet.ciiva.com/17063/pyu-rc0402-51-rohs-l-6-r-17063193.pdf?src-supplier=Future+Electronics; ComponentLink3Description: https://datasheet.ciiva.com/17063/pyu-rc0402-51-rohs-l-6-r-17063193.pdf?src-supplier=Future+Electronics; ComponentLink4URL: https://datasheet.ciiva.com/22747/1018594-22747513.pdf?src-supplier=Element14; ComponentLink4Description: https://datasheet.ciiva.com/22747/1018594-22747513.pdf?src-supplier=Element14; ComponentLink5URL: https://datasheet.ciiva.com/7849/1018594-7849869.pdf?src-supplier=Element14; ComponentLink5Description: https://datasheet.ciiva.com/7849/1018594-7849869.pdf?src-supplier=Element14; ComponentLink6URL: https://datasheet.ciiva.com/7983/1018594-7983502.pdf?src-supplier=Element14; ComponentLink6Description: https://datasheet.ciiva.com/7983/1018594-7983502.pdf?src-supplier=Element14; ComponentLink7URL: https://datasheet.ciiva.com/7849/1018594-7849871.pdf?src-supplier=Element14; ComponentLink7Description: https://datasheet.ciiva.com/7849/1018594-7849871.pdf?src-supplier=Element14; Supplier 1: Digi-Key; Manufacturer Part Number 1: RC0402FR-071KL; Stock 1: 60695854; Pricing 1: 1=0.10000, 10=0.01600, 100=0.00670, 1000=0.00301, 2500=0.00261, 5000=0.00215 (USD); Case/Package: 0402; Tolerance: 1%; Supplier Part Number 1: 311-1.00KLRCT-ND
TP1-TP4 = TEST_POINT
U7 = PMS150C-U06: Padauk 8bit OTP Type IO Controller - (SOT-23-6)

## Sheet BW1092_IMX378.SchDoc: =project_title
size Tabloid; PageSetup: Record=PageOptions|CenterHorizontal=True|CenterVertical=True|PrintScale=0.71|XCorrection=1.00|YCorrection=1.00|PrintKind=0|BorderSize=5000000|LeftOffset=0|BottomOffset=0|Orientation=2|PaperLength=1000|PaperWidth=1000|Scale=100|PaperSource=7|PrintQuality=-4|MediaType=1|DitherType=10|PrintScaleMode=1|PaperKind=A4; CompanyName: Luxonis Holding; DrawnBy: Brian Weinstein; Organization: Luxonis Holding; Address1: 1925 Harmony Park Drive; Address2: Westminster, CO; Address3: 80234; Address4: United States; DocumentNumber: DXXXX; Revision: R0M0E0; SheetNumber: 4; SheetTotal: 12
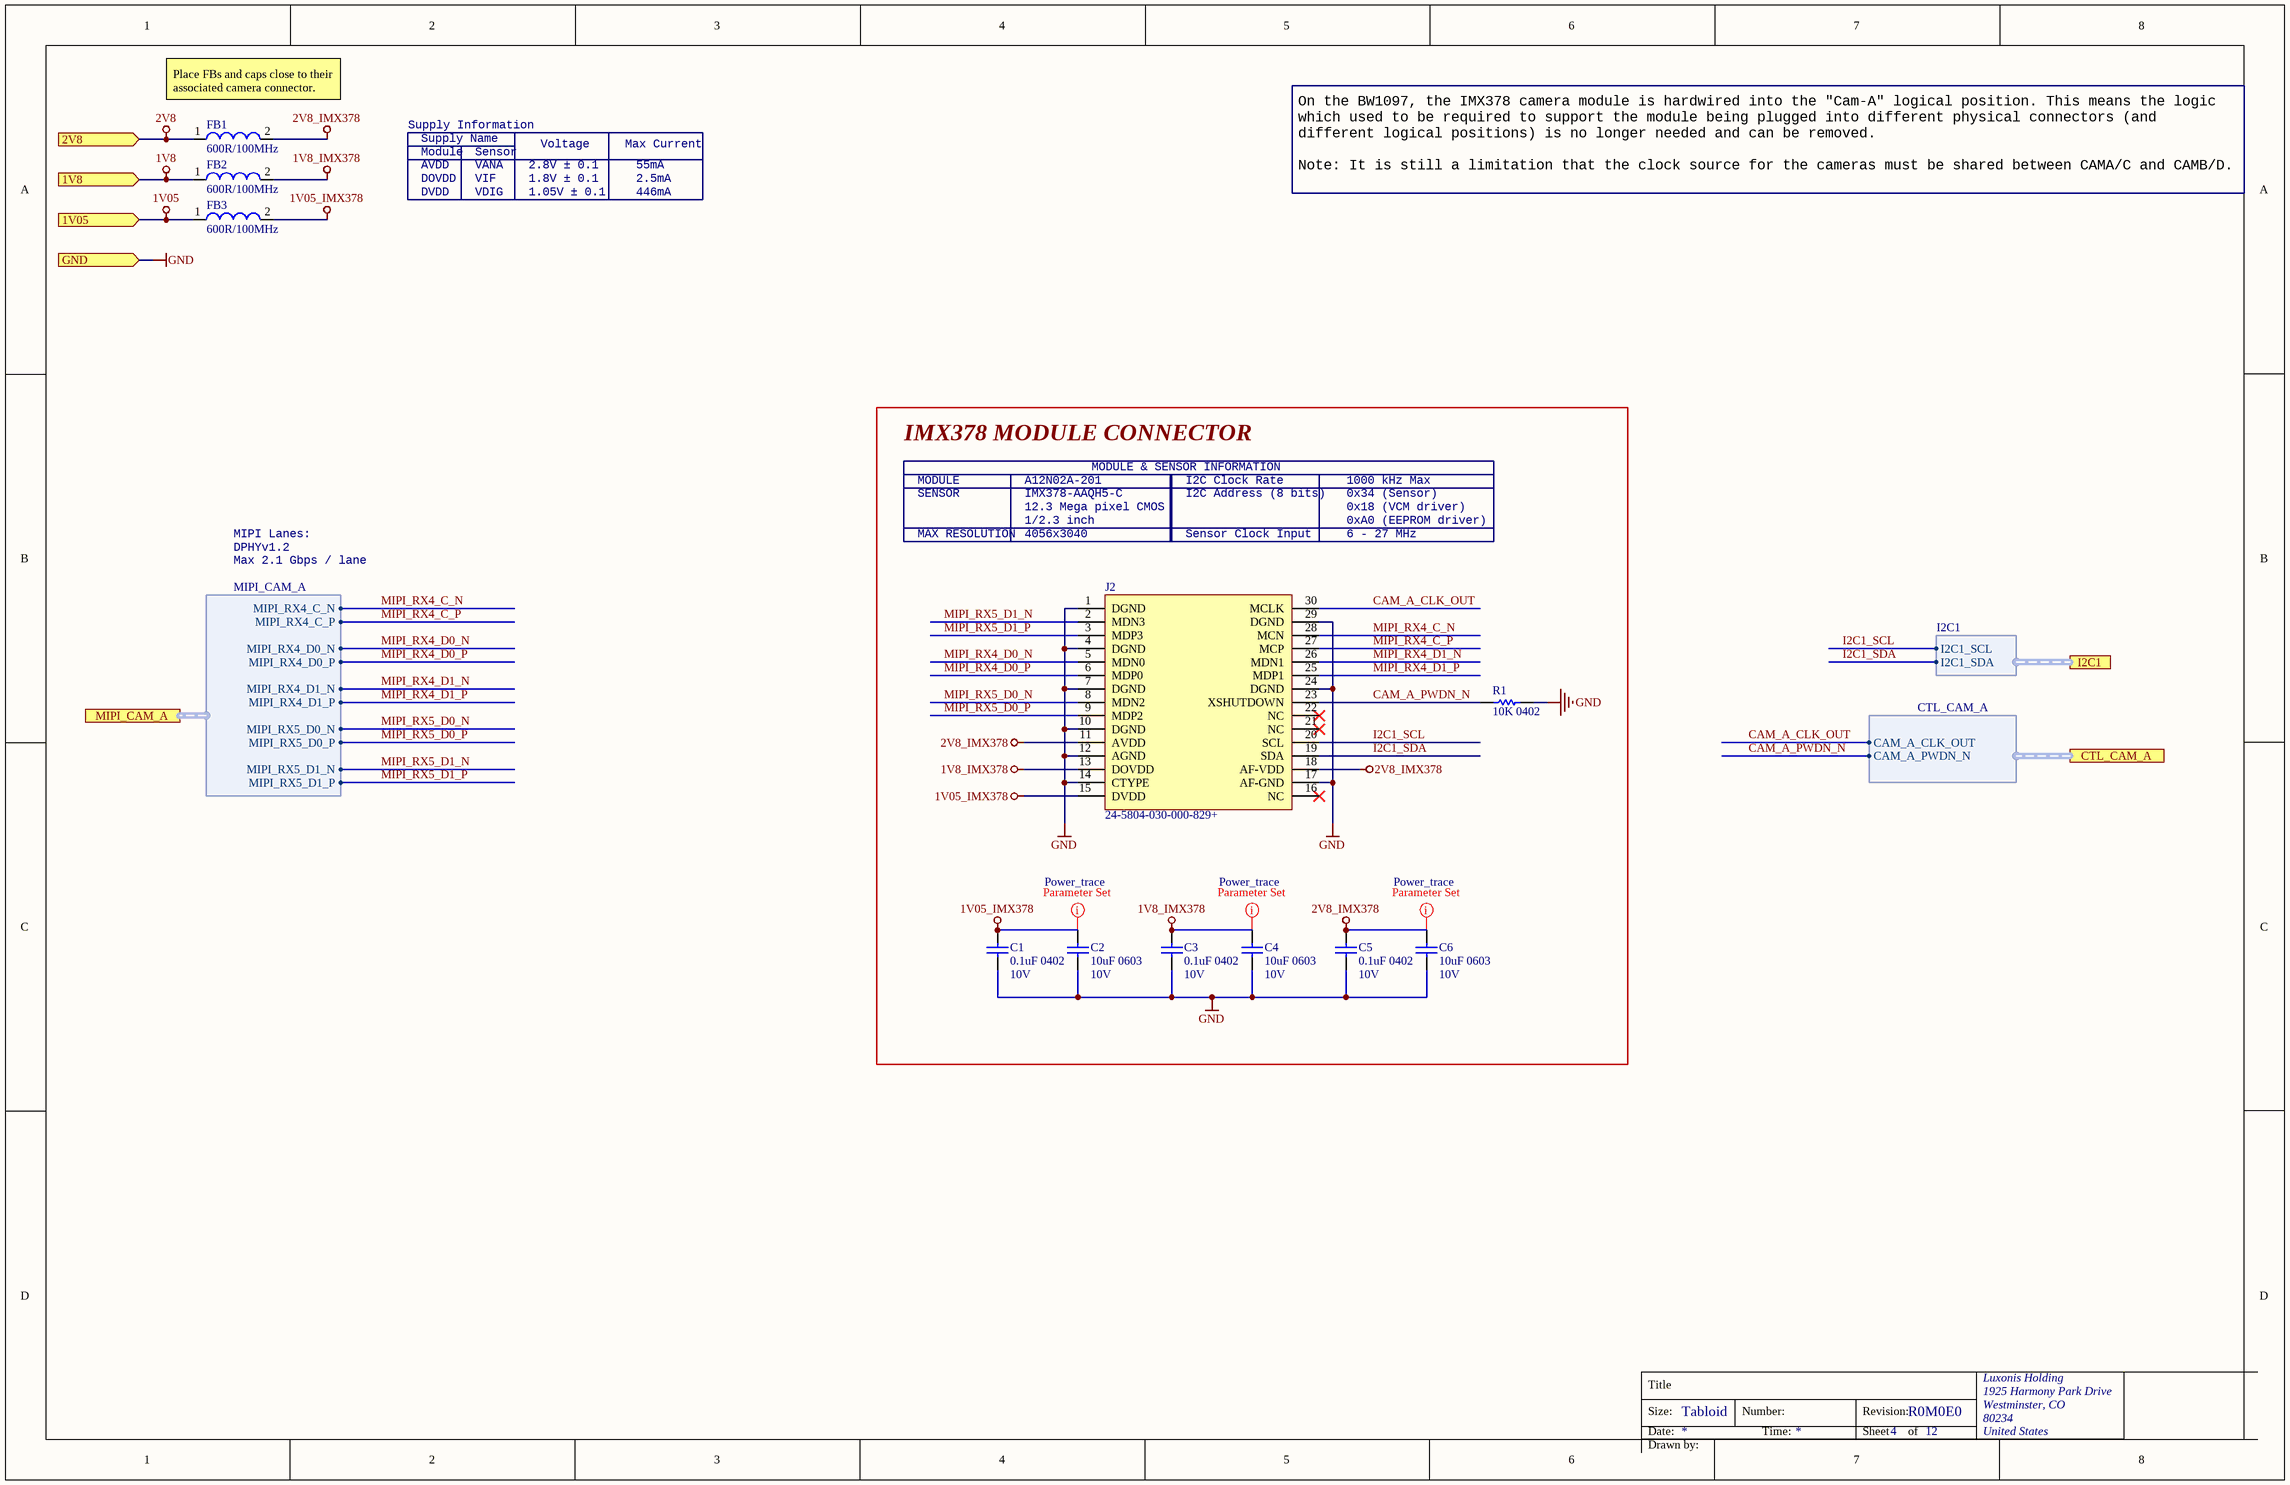
[diagram p3: BW1092_IMX378.SchDoc]

### Parts
C1  0.1uF 0402  Voltage Rating: 10V  [CAPC0402(1005)70_L]
C2  10uF 0603  Voltage Rating: 10V  [CAPC0603(1608)100_L]
C3  0.1uF 0402  Voltage Rating: 10V  [CAPC0402(1005)70_L]
C4  10uF 0603  Voltage Rating: 10V  [CAPC0603(1608)100_L]
C5  0.1uF 0402  Voltage Rating: 10V  [CAPC0402(1005)70_L]
C6  10uF 0603  Voltage Rating: 10V  [CAPC0603(1608)100_L]
FB1  600R/100MHz  [2508056017Y2]
FB2  600R/100MHz  [2508056017Y2]
FB3  600R/100MHz  [2508056017Y2]
J2  24-5804-030-000-829+  [A12N02A-201_MatedModule]
R1  10K 0402  [RESC0402(1005)_L]

### Blocks framed on the sheet
IMX378 MODULE CONNECTOR: C1-C6 J2 R1

### Ports
1V05 (in), 1V8 (in), 2V8 (in), CTL_CAM_A (harness CTL_CAM_A), GND (in), I2C1 (harness I2C1), MIPI_CAM_A (harness MIPI_CAM_A)

### Harnesses
I2C1: I2C1_SDA, I2C1_SCL
MIPI_CAM_A: MIPI_RX4_C_P, MIPI_RX4_C_N, MIPI_RX4_D0_P, MIPI_RX4_D0_N, MIPI_RX4_D1_P, MIPI_RX4_D1_N, MIPI_RX5_D0_P, MIPI_RX5_D0_N, MIPI_RX5_D1_P, MIPI_RX5_D1_N
CTL_CAM_A: CAM_A_PWDN_N, CAM_A_CLK_OUT

### Nets
1V05: FB3.1 ; port 1V05
1V05_IMX378: C1.2 C2.2 FB3.2 J2.15(DVDD)
1V8: FB2.1 ; port 1V8
1V8_IMX378: C3.2 C4.2 FB2.2 J2.13(DOVDD)
2V8: FB1.1 ; port 2V8
2V8_IMX378: C5.2 C6.2 FB1.2 J2.11(AVDD) J2.18(AF-VDD)
GND: C1.1 C2.1 C3.1 C4.1 C5.1 C6.1 J2.1(DGND) J2.4(DGND) J2.7(DGND) J2.10(DGND) J2.12(AGND) J2.14(CTYPE) J2.17(AF-GND) J2.24(DGND) J2.29(DGND) R1.2 ; port GND
CAM_A_CLK_OUT: J2.30(MCLK) ; port CTL_CAM_A.CAM_A_CLK_OUT
CAM_A_PWDN_N: J2.23(XSHUTDOWN) R1.1 ; port CTL_CAM_A.CAM_A_PWDN_N
I2C1_SCL: J2.20(SCL) ; port I2C1.I2C1_SCL
I2C1_SDA: J2.19(SDA) ; port I2C1.I2C1_SDA
MIPI_RX4_C_N: J2.28(MCN) ; port MIPI_CAM_A.MIPI_RX4_C_N
MIPI_RX4_C_P: J2.27(MCP) ; port MIPI_CAM_A.MIPI_RX4_C_P
MIPI_RX4_D0_N: J2.5(MDN0) ; port MIPI_CAM_A.MIPI_RX4_D0_N
MIPI_RX4_D0_P: J2.6(MDP0) ; port MIPI_CAM_A.MIPI_RX4_D0_P
MIPI_RX4_D1_N: J2.26(MDN1) ; port MIPI_CAM_A.MIPI_RX4_D1_N
MIPI_RX4_D1_P: J2.25(MDP1) ; port MIPI_CAM_A.MIPI_RX4_D1_P
MIPI_RX5_D0_N: J2.8(MDN2) ; port MIPI_CAM_A.MIPI_RX5_D0_N
MIPI_RX5_D0_P: J2.9(MDP2) ; port MIPI_CAM_A.MIPI_RX5_D0_P
MIPI_RX5_D1_N: J2.2(MDN3) ; port MIPI_CAM_A.MIPI_RX5_D1_N
MIPI_RX5_D1_P: J2.3(MDP3) ; port MIPI_CAM_A.MIPI_RX5_D1_P

Not connected (* = marked no-connect by the designer): J2 16(NC)* 21(NC)* 22(NC)*

### Layout directives
net class Power_trace: 1V05_IMX378, 1V8_IMX378, 2V8_IMX378

### Notes on the sheet
- (near FB1) Place FBs and caps close to their associated camera connector.
- Supply Information
- AVDD
- Supply Name
- Module
- VANA
- Sensor
- 2.8V ± 0.1
- Voltage
- Max Current
- 55mA
- DOVDD
- DVDD
- VIF
- VDIG
- 1.8V ± 0.1
- 1.05V ± 0.1
- 2.5mA
- 446mA
- On the BW1097, the IMX378 camera module is hardwired into the "Cam-A" logical position. This means the logic which used to be required to support the module being plugged into different physical connectors (and different logical positions) is no longer needed and can be removed.
  Note: It is still a limitation that the clock source for the cameras must be shared between CAMA/C and CAMB/D.
- SENSOR
- MODULE
- IMX378-AAQH5-C
- A12N02A-201
- MODULE & SENSOR INFORMATION
- I2C Address (8 bits)
- I2C Clock Rate
- 0x34 (Sensor)
- 1000 kHz Max
- MIPI Lanes:
- Max 2.1 Gbps / lane
- DPHYv1.2
- MAX RESOLUTION
- 12.3 Mega pixel CMOS
- 4056x3040
- 1/2.3 inch
- Sensor Clock Input
- 0x18 (VCM driver)
- 0xA0 (EEPROM driver)
- 6 - 27 MHz
- Title
- Size:
- Date:
- Tabloid
- Number:
- Time:
- Revision:
- Sheet
- of
- Drawn by:

### Library data of the parts
C1 C3 C5 = GRM155R71A104JA01D: CAP CER 0.1UF 10V X7R 0402 5%; Manufacturer 1: Murata; Capacitance: 100nF; Supplier 1: Digi-Key; Manufacturer Part Number 1: GRM155R71A104JA01D; Stock 1: 1346709; Pricing 1: 1=0.10000, 10=0.02500, 100=0.01130, 500=0.00806, 1000=0.00633, 2500=0.00575, 5000=0.00529 (USD); RoHS: Yes; Mount: Surface Mount; Case/Package: 0402; Case Code (Imperial): 0402; Case Code (Metric): 1005; Min Operating Temperature: -55°C; Max Operating Temperature: 125°C; Tolerance: 5%; Packaging: Tape and Reel; Voltage Rating (DC): 10V; Dielectric: X7R; Package Quantity: 10000; Termination: SMD/SMT; Length: 1mm; Height: 0.5mm; Width: 0.02inch; Thickness: 0.022inch; Depth: 0.5mm; Radiation Hardening: No; Lead Free: Lead Free; ComponentLink1URL: https://datasheet.ciiva.com/5411/product-5411135.pdf?src-supplier=Mouser; ComponentLink1Description: https://datasheet.ciiva.com/5411/product-5411135.pdf?src-supplier=Mouser; ComponentLink2URL: https://datasheet.ciiva.com/11618/c02e-11618821.pdf?src-supplier=Avnet; ComponentLink2Description: https://datasheet.ciiva.com/11618/c02e-11618821.pdf?src-supplier=Avnet; Supplier Part Number 1: 490-10777-1-ND
C2 C4 C6 = GRM188R61A106ME69D: CAP CER 10UF 10V X5R 0603 20%; Manufacturer 1: Murata; Material: Ceramic; Supplier 1: Digi-Key; Manufacturer Part Number 1: GRM188R61A106ME69D; Stock 1: 2873098; Pricing 1: 1=0.21000, 10=0.14100, 100=0.07130, 500=0.04876, 1000=0.04313 (USD); RoHS: Yes; Mount: Surface Mount; Case/Package: 0603; Weight: 0.000222oz; Case Code (Metric): 1608; Case Code (Imperial): 0603; Min Operating Temperature: -55°C; Max Operating Temperature: 85°C; Packaging: Tape and Reel; Tolerance: 20%; Capacitance: 10uF; Dielectric: X5R; Voltage Rating (DC): 10V; Package Quantity: 4000; Termination: SMD/SMT; Length: 1.6mm; Height: 0.8mm; Width: 0.8mm; Thickness: 0.035inch; Depth: 0.8mm; REACH SVHC: Unknown; Lead Free: Lead Free; ComponentLink1URL: http://www.mouser.com/ds/2/281/c02e-2905.pdf?src-supplier=Mouser; ComponentLink1Description: http://www.mouser.com/ds/2/281/c02e-2905.pdf?src-supplier=Mouser; ComponentLink2URL: http://components.arrow.com/part/dataview/0323_06119472?src-supplier=Arrow+Europe; ComponentLink2Description: http://components.arrow.com/part/dataview/0323_06119472?src-supplier=Arrow+Europe; ComponentLink3URL: http://www.farnell.com/datasheets/2048014.pdf?src-supplier=Farnell; ComponentLink3Description: http://www.farnell.com/datasheets/2048014.pdf?src-supplier=Farnell; ComponentLink4URL: http://www.farnell.com/datasheets/1872210.pdf?src-supplier=Farnell; ComponentLink4Description: http://www.farnell.com/datasheets/1872210.pdf?src-supplier=Farnell; ComponentLink5URL: http://search.murata.co.jp/Ceramy/image/img/A01X/G101/ENG/GRM188R61A106ME69-01.pdf?src-supplier=Digi-Key; ComponentLink5Description: http://search.murata.co.jp/Ceramy/image/img/A01X/G101/ENG/GRM188R61A106ME69-01.pdf?src-supplier=Digi-Key; ComponentLink6URL: http://www.farnell.com/datasheets/1872210.pdf?src-supplier=Newark; ComponentLink6Description: http://www.farnell.com/datasheets/1872210.pdf?src-supplier=Newark; ComponentLink7URL: http://www.farnell.com/datasheets/2048014.pdf?src-supplier=Element14; ComponentLink7Description: http://www.farnell.com/datasheets/2048014.pdf?src-supplier=Element14; ComponentLink8URL: http://www.farnell.com/datasheets/2048014.pdf?src-supplier=Newark; ComponentLink8Description: http://www.farnell.com/datasheets/2048014.pdf?src-supplier=Newark; Supplier Part Number 1: 490-10475-1-ND
FB1-FB3 = 2508056017Y2: FERRITE BEAD, 0.1OHM, 2A, 0805, 600R/100MHz; Manufacturer 1: Fair-Rite; Impedance: 600R; Tolerance: 25%; Resistance: 350mR; DC Resistance (DCR): 100mR; Test Frequency: 100MHz; Supplier 1: Digi-Key; Manufacturer Part Number 1: 2508056017Y2; Stock 1: 100491; Pricing 1: 1=0.10000, 10=0.07900, 25=0.07120, 50=0.05240, 100=0.04520, 250=0.03568, 500=0.03014, 1000=0.02538 (USD); RoHS: Yes; Case/Package: 0805; Number of Pins: 2; Case Code (Metric): 2012; Case Code (Imperial): 0805; Min Operating Temperature: -55°C; Max Operating Temperature: 125°C; Package Quantity: 4000; Packaging: Tape and Reel; Max DC Current: 2A; Termination: SMD/SMT; Military Standard: Not; DC Current: 2A; Current Rating: 2A; Frequency: 100MHz; Length: 2mm; Height: 0.9mm; Width: 1.25mm; Depth: 1.25mm; Radiation Hardening: No; REACH SVHC: No SVHC; ComponentLink1URL: https://datasheet.ciiva.com/3854/3802508056017y2-3854245.pdf?src-supplier=Arrow; ComponentLink1Description: https://datasheet.ciiva.com/3854/3802508056017y2-3854245.pdf?src-supplier=Arrow; ComponentLink2URL: https://datasheet.ciiva.com/22735/652149-22735047.pdf?src-supplier=Element14; ComponentLink2Description: https://datasheet.ciiva.com/22735/652149-22735047.pdf?src-supplier=Element14; ComponentLink3URL: https://datasheet.ciiva.com/1127/26143-1127514.pdf?src-supplier=Farnell; ComponentLink3Description: https://datasheet.ciiva.com/1127/26143-1127514.pdf?src-supplier=Farnell; ComponentLink4URL: https://datasheet.ciiva.com/18090/getdatasheetpartid-212640-18090187.pdf?src-supplier=Verical; ComponentLink4Description: https://datasheet.ciiva.com/18090/getdatasheetpartid-212640-18090187.pdf?src-supplier=Verical; ComponentLink5URL: https://datasheet.ciiva.com/7620/26143-7620140.pdf?src-supplier=Element14; ComponentLink5Description: https://datasheet.ciiva.com/7620/26143-7620140.pdf?src-supplier=Element14; Supplier Part Number 1: 1934-1487-1-ND
J2 = A12N02A-201_Connector: CONN Series 5804 board to board 0.4mm pitch 30 way connector; Manufacturer 1: Kyocera International Electronic Components; Manufacturer Part Number 1: 245804030000829+; MAN: AVX/KYOCERA; Supplier 1: Digi-Key; Stock 1: 11469; Pricing 1: 1=1.69000, 10=1.53600, 25=1.44200, 50=1.37940, 100=1.31670, 250=1.19132, 500=1.09726, 1000=0.94050 (USD); RoHS: Yes; ComponentLink1URL: http://global.kyocera.com/prdct/electro/product/pdf/5804.pdf?src-supplier=Digi-Key; ComponentLink1Description: http://global.kyocera.com/prdct/electro/product/pdf/5804.pdf?src-supplier=Digi-Key; Supplier Part Number 1: 478-12013-1-ND; MAN PN: 24-5804-030-000-829+
R1 = RC0402FR-1310KL: RES SMD 10K OHM 1% 0402 1/16W Chip Resistor, 0402 [1005 Metric], 10 kohm, RC Series, 50 V, Thick Film, 62.5 mW; Manufacturer 1: Yageo; Resistance: 10kR; Temperature Coefficient: 100ppm/°C; Power Rating: 62.5mW; Voltage Rating: 50V; ComponentLink1URL: https://datasheet.ciiva.com/16940/pyu-rc0402-51-rohs-l-6-16940293.pdf?src-supplier=Avnet+Europe; ComponentLink1Description: https://datasheet.ciiva.com/16940/pyu-rc0402-51-rohs-l-6-16940293.pdf?src-supplier=Avnet+Europe; ComponentLink2URL: https://datasheet.ciiva.com/28386/pyu-rc0402-51-rohs-l-6-28386855.pdf?src-supplier=Avnet+Europe; ComponentLink2Description: https://datasheet.ciiva.com/28386/pyu-rc0402-51-rohs-l-6-28386855.pdf?src-supplier=Avnet+Europe; ComponentLink3URL: https://datasheet.ciiva.com/16740/pyu-rc0402-51-rohs-l-6-r-16740602.pdf?src-supplier=Future+Electronics; ComponentLink3Description: https://datasheet.ciiva.com/16740/pyu-rc0402-51-rohs-l-6-r-16740602.pdf?src-supplier=Future+Electronics; ComponentLink4URL: https://datasheet.ciiva.com/8891/pyu-rc0402-51-rohs-l-6-8891339.pdf?src-supplier=Avnet; ComponentLink4Description: https://datasheet.ciiva.com/8891/pyu-rc0402-51-rohs-l-6-8891339.pdf?src-supplier=Avnet; ComponentLink5URL: https://datasheet.ciiva.com/5557/pyu-rc0402-51-rohs-l-6-r-5557997.pdf?src-supplier=Mouser; ComponentLink5Description: https://datasheet.ciiva.com/5557/pyu-rc0402-51-rohs-l-6-r-5557997.pdf?src-supplier=Mouser; ComponentLink6URL: https://datasheet.ciiva.com/7983/1018594-7983533.pdf?src-supplier=Element14; ComponentLink6Description: https://datasheet.ciiva.com/7983/1018594-7983533.pdf?src-supplier=Element14; Supplier 1: Newark; Manufacturer Part Number 1: RC0402FR-1310KL; Stock 1: 62239; Pricing 1: 1=0.10000, 25=0.01200, 100=0.00400, 250=0.00400, 500=0.00300, 1000=0.00300 (USD); RoHS: Yes; Case/Package: 0402; Number of Pins: 2; Contact Plating: Tin,Matte,Lead; Case Code (Imperial): 0402; Case Code (Metric): 1005; Min Operating Temperature: -55°C; Max Operating Temperature: 155°C; Tolerance: 1%; Composition: Thick Film; Packaging: Tape and Reel; Termination: SMD/SMT; Military Standard: Not; Voltage Rating (DC): 50V; Working Voltage: 50V; Number of Terminations: 2; Length: 1mm; Depth: 0.5mm; Radiation Hardening: No; REACH SVHC: No SVHC; Lead Free: Lead Free; Supplier Part Number 1: 67R9960